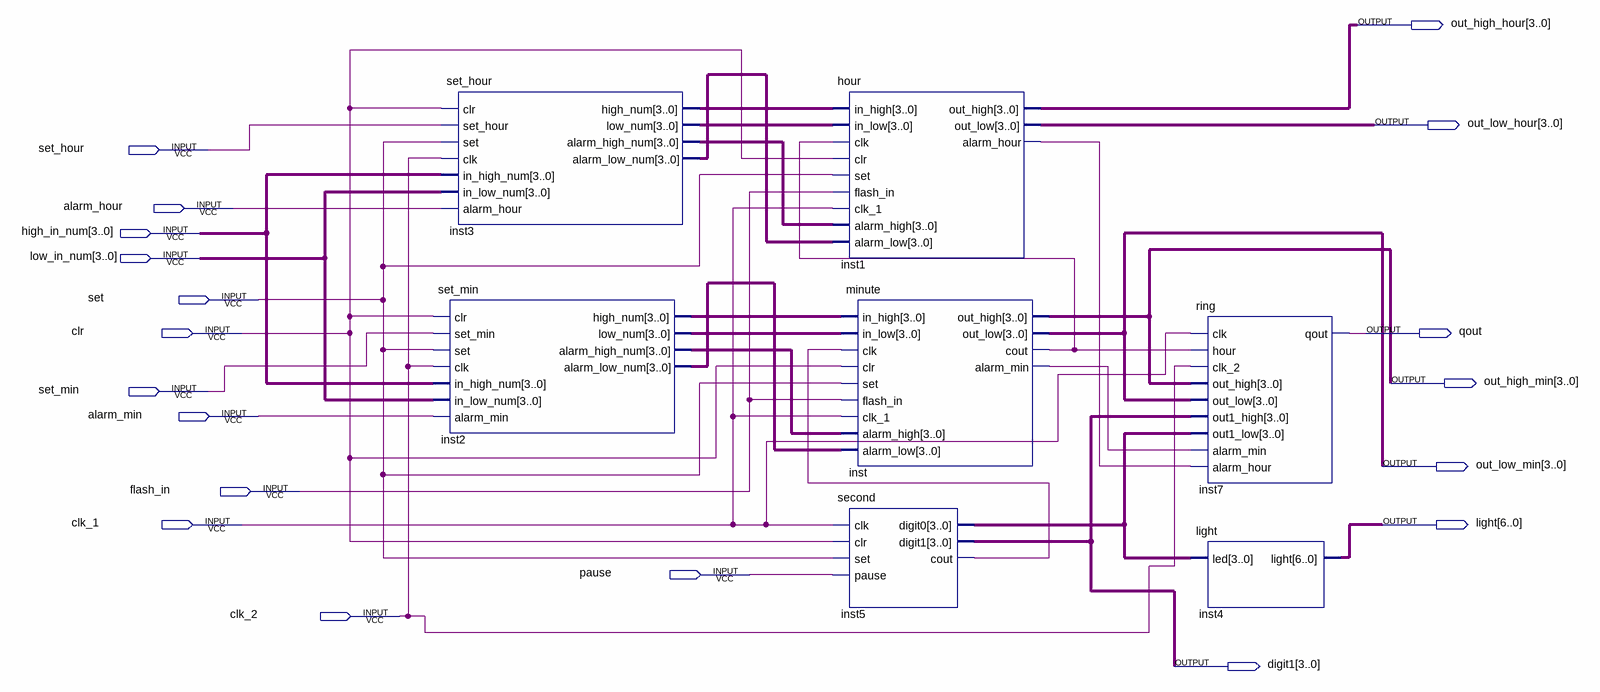
[diagram p0: schematic sheet]
// Quartus schematic Clock.bdf as structural Verilog: 7 symbols, 19 pins
module Clock (
  input  set_hour,
  input  alarm_hour,
  input  [3:0] high_in_num,
  input  [3:0] low_in_num,
  input  set,
  input  clr,
  input  set_min,
  input  alarm_min,
  input  flash_in,
  input  clk_1,
  input  pause,
  input  clk_2,
  output [3:0] out_high_hour,
  output [3:0] out_low_hour,
  output qout,
  output [3:0] out_high_min,
  output [3:0] out_low_min,
  output [6:0] light,
  output [3:0] digit1
);

  wire inst1_alarm_hour, inst5_cout, inst_alarm_min, inst_cout;
  wire [3:0] inst2_alarm_high_num, inst2_alarm_low_num, inst2_high_num, inst2_low_num, inst3_alarm_high_num,
       inst3_alarm_low_num, inst3_high_num, inst3_low_num, inst5_digit0;

  set_hour inst3 (
    .clr(clr), .set_hour(set_hour), .set(set), .clk(clk_2), .in_high_num(high_in_num),
    .in_low_num(low_in_num), .alarm_hour(alarm_hour), .high_num(inst3_high_num), .low_num(inst3_low_num),
    .alarm_high_num(inst3_alarm_high_num), .alarm_low_num(inst3_alarm_low_num));
  set_min inst2 (
    .clr(clr), .set_min(set_min), .set(set), .clk(clk_2), .in_high_num(high_in_num), .in_low_num(low_in_num),
    .alarm_min(alarm_min), .high_num(inst2_high_num), .low_num(inst2_low_num),
    .alarm_high_num(inst2_alarm_high_num), .alarm_low_num(inst2_alarm_low_num));
  hour inst1 (
    .in_high(inst3_high_num), .in_low(inst3_low_num), .clk(inst_cout), .clr(clr), .set(set),
    .flash_in(flash_in), .clk_1(clk_1), .alarm_high(inst3_alarm_high_num), .alarm_low(inst3_alarm_low_num),
    .out_high(out_high_hour), .out_low(out_low_hour), .alarm_hour(inst1_alarm_hour));
  minute inst (
    .in_high(inst2_high_num), .in_low(inst2_low_num), .clk(inst5_cout), .clr(clr), .set(set),
    .flash_in(flash_in), .clk_1(clk_1), .alarm_high(inst2_alarm_high_num), .alarm_low(inst2_alarm_low_num),
    .out_high(out_high_min), .out_low(out_low_min), .cout(inst_cout), .alarm_min(inst_alarm_min));
  second inst5 (
    .clk(clk_1), .clr(clr), .set(set), .pause(pause), .digit0(inst5_digit0), .digit1(digit1),
    .cout(inst5_cout));
  ring inst7 (
    .clk(clk_1), .hour(inst_cout), .clk_2(clk_2), .out_high(out_high_min), .out_low(out_low_min),
    .out1_high(digit1), .out1_low(inst5_digit0), .alarm_min(inst_alarm_min), .alarm_hour(inst1_alarm_hour),
    .qout(qout));
  light inst4 (.led(inst5_digit0), .light(light));
endmodule
